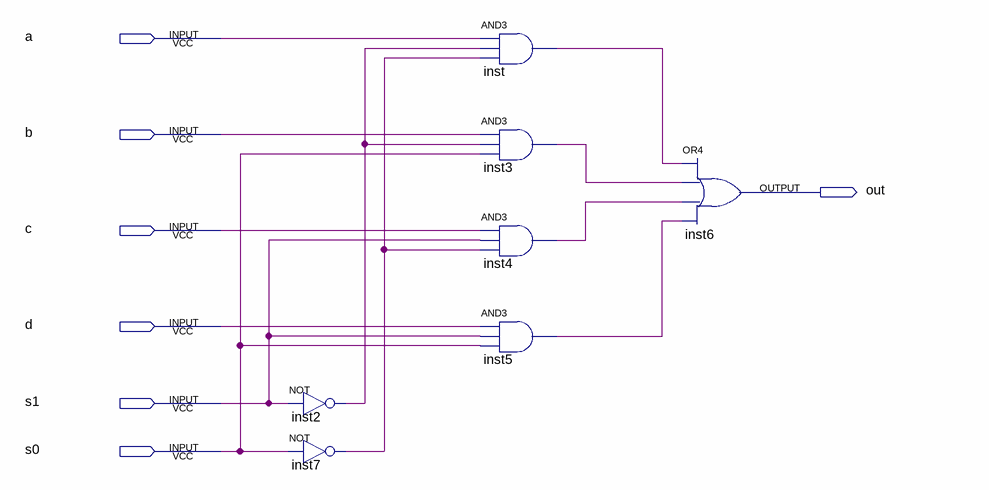
[diagram p0: schematic sheet]
// Quartus schematic mux4to1.bdf as structural Verilog: 7 symbols, 7 pins
module mux4to1 (
  input  a,
  input  b,
  input  c,
  input  d,
  input  s1,
  input  s0,
  output out
);

  wire inst2_out, inst3_out, inst4_out, inst5_out, inst7_out, inst_out;

  not inst2 (inst2_out, s1);
  not inst7 (inst7_out, s0);
  and inst (inst_out, a, inst2_out, inst7_out);
  and inst3 (inst3_out, b, inst2_out, s0);
  and inst4 (inst4_out, c, s1, inst7_out);
  and inst5 (inst5_out, d, s1, s0);
  or inst6 (out, inst_out, inst3_out, inst4_out, inst5_out);
endmodule
